# Altium schematic sheet MCU Peripherals.SchDoc
size A4; SheetNumber: 3; SheetTotal: 4
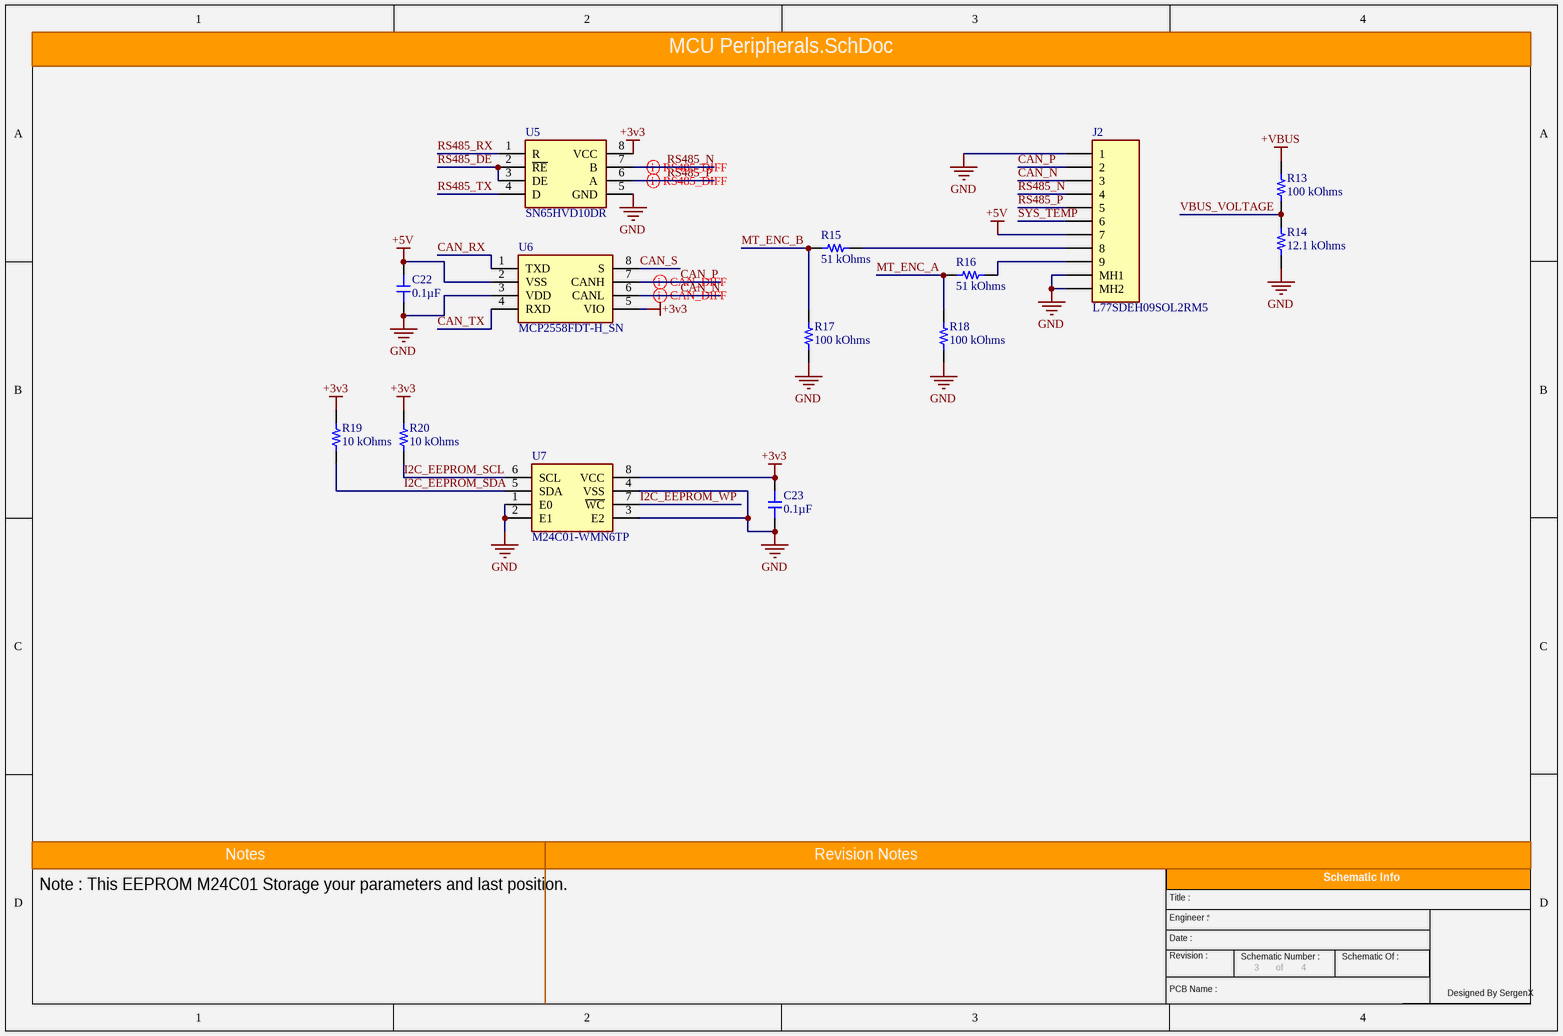
[diagram p0: MCU Peripherals.SchDoc]

## Parts
C22  0.1µF  [0603_Footprint]
C23  0.1µF  [0603_Footprint]
J2  L77SDEH09SOL2RM5  [L77SDEH09SOL2RM5]
R13  100 kOhms  [0603_RES]
R14  12.1 kOhms  [0603_RES]
R15  51 kOhms  [0603_RES]
R16  51 kOhms  [0603_RES]
R17  100 kOhms  [0603_RES]
R18  100 kOhms  [0603_RES]
R19  10 kOhms  [0603_RES]
R20  10 kOhms  [0603_RES]
U5  SN65HVD10DR  [SOIC127P600X175-8N]
U6  MCP2558FDT-H_SN  [SOIC127P600X175-8N]
U7  M24C01-WMN6TP  [SOIC127P600X175-8N]

## Nets
+3v3: C23.1 R19.2 R20.2 U5.8(VCC) U6.5(VIO) U7.8(VCC)
+5V: C22.1 J2.7 U6.2(VSS)
+VBUS: R13.2
GND: C22.2 C23.2 J2.1 J2.MH1 J2.MH2 R14.1 R17.1 R18.1 U5.5(GND) U6.3(VDD) U7.1(E0) U7.2(E1) U7.3(E2) U7.4(VSS)
CAN_N: J2.3 U6.6(CANL)
CAN_P: J2.2 U6.7(CANH)
CAN_RX: U6.1(TXD)
CAN_S: U6.8(S)
CAN_TX: U6.4(RXD)
I2C_EEPROM_SCL: R20.1 U7.6(SCL)
I2C_EEPROM_SDA: R19.1 U7.5(SDA)
I2C_EEPROM_WP: U7.7(~{WC})
MT_ENC_A: R16.2 R18.2
MT_ENC_B: R15.2 R17.2
RS485_DE: U5.2(~{RE}) U5.3(DE)
RS485_N: J2.4 U5.7(B)
RS485_P: J2.5 U5.6(A)
RS485_RX: U5.1(R)
RS485_TX: U5.4(D)
SYS_TEMP: J2.6
VBUS_VOLTAGE: R13.1 R14.2
NetJ2_8: J2.8 R15.1
NetJ2_9: J2.9 R16.1

## Layout directives
differential pair; differential pair class CAN_DIFF: CAN_N, CAN_P
differential pair; differential pair class RS485_DIFF: RS485_N, RS485_P

## Notes on the sheet
- Note : This EEPROM M24C01 Storage your parameters and last position.
- Notes
- Revision Notes
- Title :
- Engineer :
- Schematic Info
- Date :
- Revision :
- PCB Name :
- Schematic Number :
- of
- Schematic Of :
- Designed By SergenX

## Library data of the parts
C22 C23 = 0.1uF 0603 Surface Capacitor
J2 = L77SDEH09SOL2RM5: Dsub, Stamped Signal 3A, Straight PCB Thru Hole,  09 Socket, Flash Gold, Bright Tin Shell, 4-40 Threaded Standoff 6.0mm (0.236in), With Boardlock 4.2mm (0.165in); Manufacturer_Name: Amphenol Communications Solutions; Geometry.Height: 12.5mm; Manufacturer_Part_Number: L77SDEH09SOL2RM5; Mouser Part Number: 523-L77SDEH09SOL2RM5; Mouser Price/Stock: https://www.mouser.co.uk/ProductDetail/Amphenol-Commercial-Products/L77SDEH09SOL2RM5?qs=mq7kV%2Fq8lk5mrczxfq2%252BXg%3D%3D; Arrow Part Number: L77SDEH09SOL2RM5; Arrow Price/Stock: https://www.arrow.com/en/products/l77sdeh09sol2rm5/amphenol-fci?region=nac; Datasheet Link: https://cdn.amphenol-cs.com/media/wysiwyg/files/drawing/l77sdxhxxsol2rm5.pdf
R13 R17 R18 = 100k Ohm 0603
R14 = 12.1 kOhms 0603
R15 R16 = 51k Ohm 0603
R19 R20 = 10 kOhms 0603
U5 = SN65HVD10DR: 3.3V RS485 TRANSRECEIVER IC; Manufacturer_Name: Texas Instruments; Datasheet Link: http://www.ti.com/lit/gpn/sn65hvd10; Height: 1.75mm; Manufacturer_Part_Number: SN65HVD10DR; Mouser Part Number: 595-SN65HVD10DR; Mouser Price/Stock: https://www.mouser.co.uk/ProductDetail/Texas-Instruments/SN65HVD10DR?qs=QViXGNcIEAviyhAwS0yoXQ%3D%3D; Arrow Part Number: SN65HVD10DR; Arrow Price/Stock: https://www.arrow.com/en/products/sn65hvd10dr/texas-instruments?region=nac
U6 = MCP2558FDT-H_SN: CAN Interface IC CAN FD Transceiver with Silent Mode; Manufacturer_Name: Microchip; Manufacturer_Part_Number: MCP2558FDT-H/SN; Geometry.Height: 1.75mm; Mouser Part Number: 579-MCP2558FDT-H/SN; Mouser Price/Stock: https://www.mouser.co.uk/ProductDetail/Microchip-Technology/MCP2558FDT-H-SN?qs=ZEMkBHnybRFERYnvJEsEHA%3D%3D; Arrow Part Number: MCP2558FDT-H/SN; Arrow Price/Stock: https://www.arrow.com/en/products/mcp2558fdt-hsn/microchip-technology?region=nac; Datasheet Link: https://ww1.microchip.com/downloads/en/DeviceDoc/20005533A.pdf
U7 = M24C01-WMN6TP: EEPROM Memory IC 1Kb (128 x 8) IÂ²C 400kHz 900ns 8-SO; MF: STMicroelectronics; Mouser-Purchase-URL: https://snapeda.com/shop?store=Mouser&id=104564; DigiKey-Purchase-URL: https://snapeda.com/shop?store=DigiKey&id=104564; SnapEDA_Link: https://www.snapeda.com/parts/M24C01-WMN6TP/STMicroelectronics/view-part/104564/?ref=snap; Availability: Warning; MP: M24C01-WMN6TP; Price: None; Package: SO-8 STMicroelectronics; Value: *